# Altium schematic sheet COVER.SchDoc
size A4
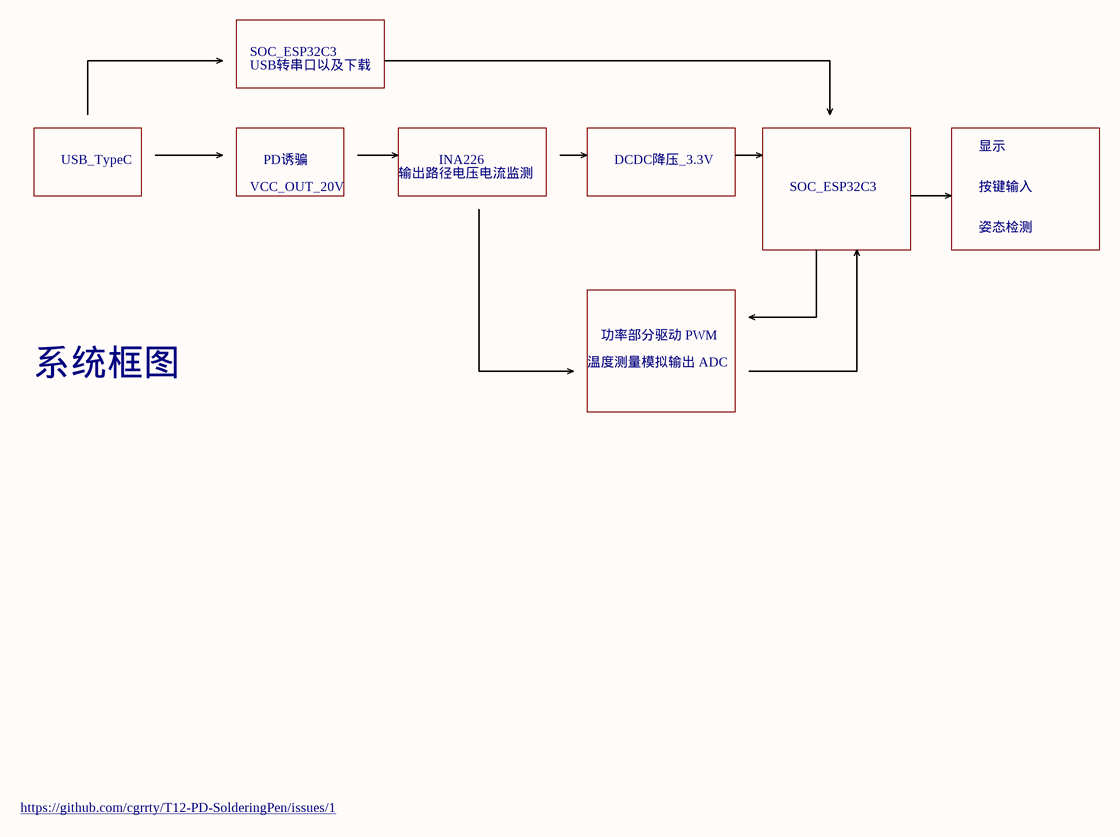
[diagram p0: COVER.SchDoc]

## Notes on the sheet
- SOC_ESP32C3
- USB转串口以及下载
- 显示
- USB_TypeC
- VCC_OUT_20V
- PD诱骗
- 输出路径电压电流监测
- INA226
- DCDC降压_3.3V
- 按键输入
- 姿态检测
- 功率部分驱动 PWM
- 系统框图
- 温度测量模拟输出 ADC
- https://github.com/cgrrty/T12-PD-SolderingPen/issues/1